# Altium schematic sheet 00_Overview.SchDoc
size A3; SheetNumber: 1; SheetTotal: 12
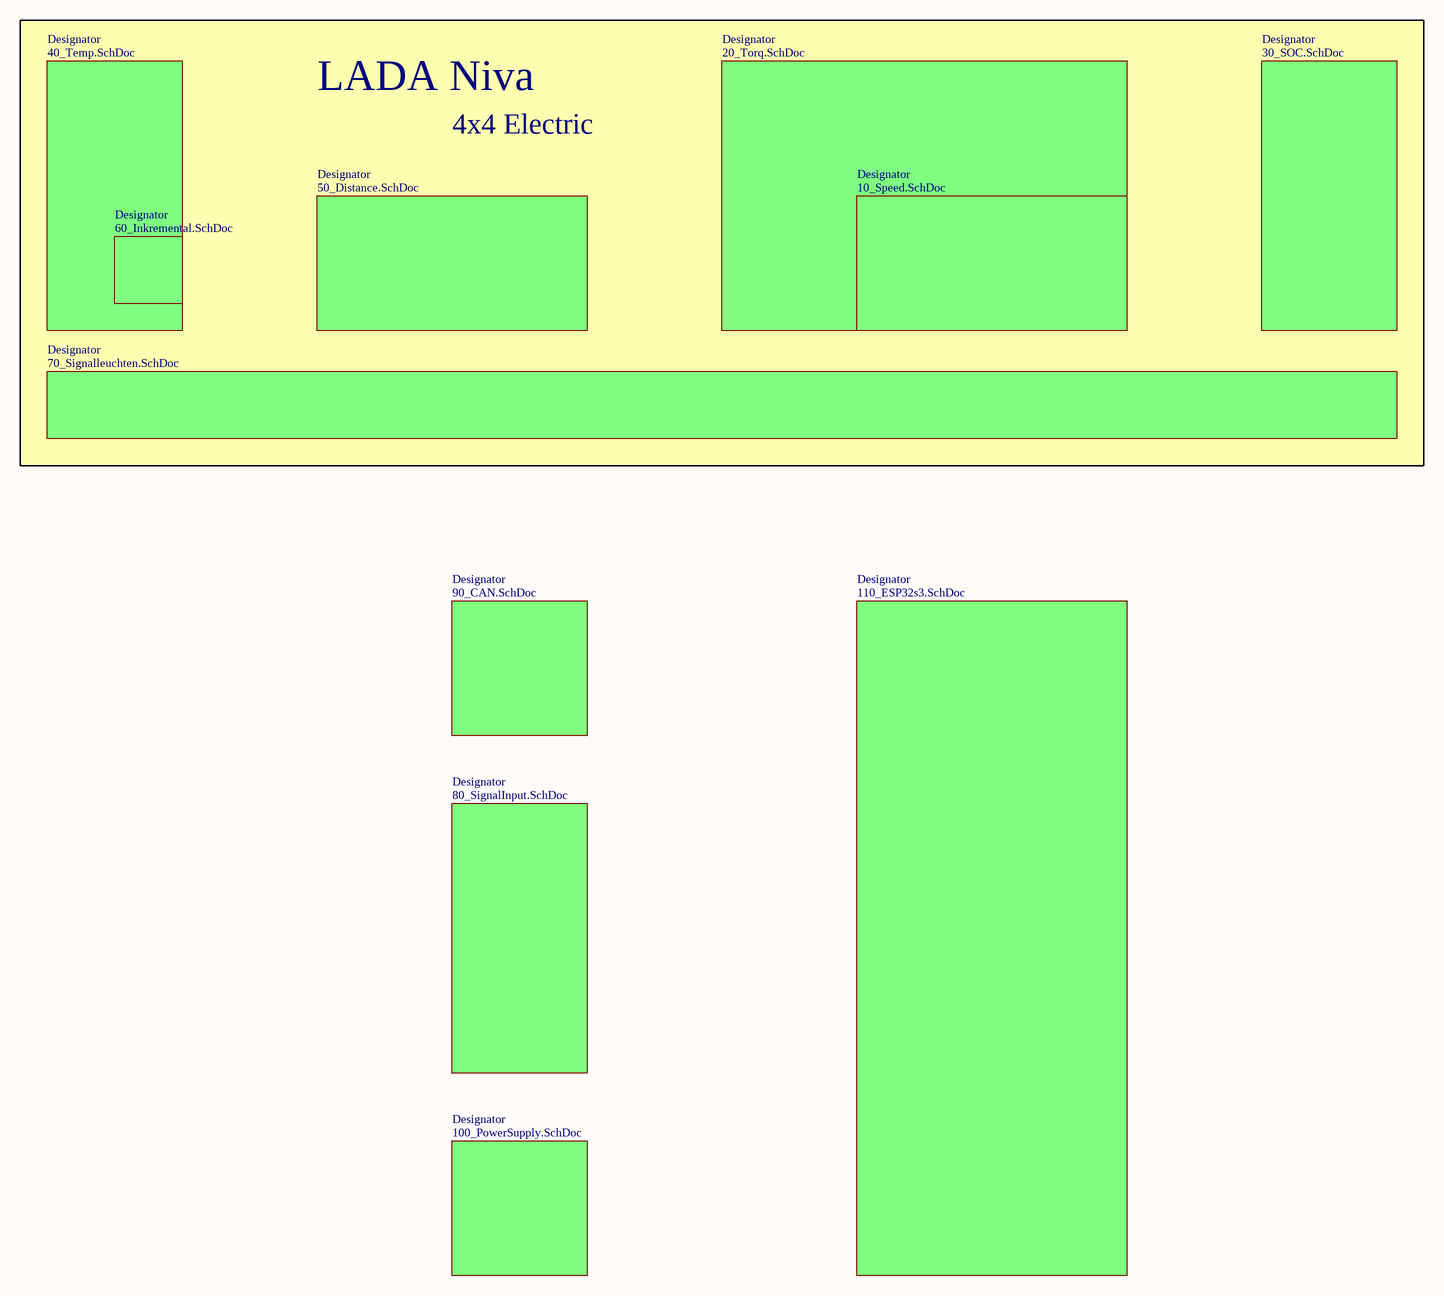
[diagram p0: 00_Overview.SchDoc]

## Sub-sheets
Designator = 110_ESP32s3.SchDoc: no entries
Designator = 20_Torq.SchDoc: no entries
Designator = 10_Speed.SchDoc: no entries
Designator = 30_SOC.SchDoc: no entries
Designator = 40_Temp.SchDoc: no entries
Designator = 70_Signalleuchten.SchDoc: no entries
Designator = 50_Distance.SchDoc: no entries
Designator = 60_Inkremental.SchDoc: no entries
Designator = 80_SignalInput.SchDoc: no entries
Designator = 100_PowerSupply.SchDoc: no entries
Designator = 90_CAN.SchDoc: no entries

## Notes on the sheet
- LADA Niva
- 4x4 Electric